# Altium schematic sheet Power3.3V.SchDoc
size A4; SheetNumber: 5; SheetTotal: 8
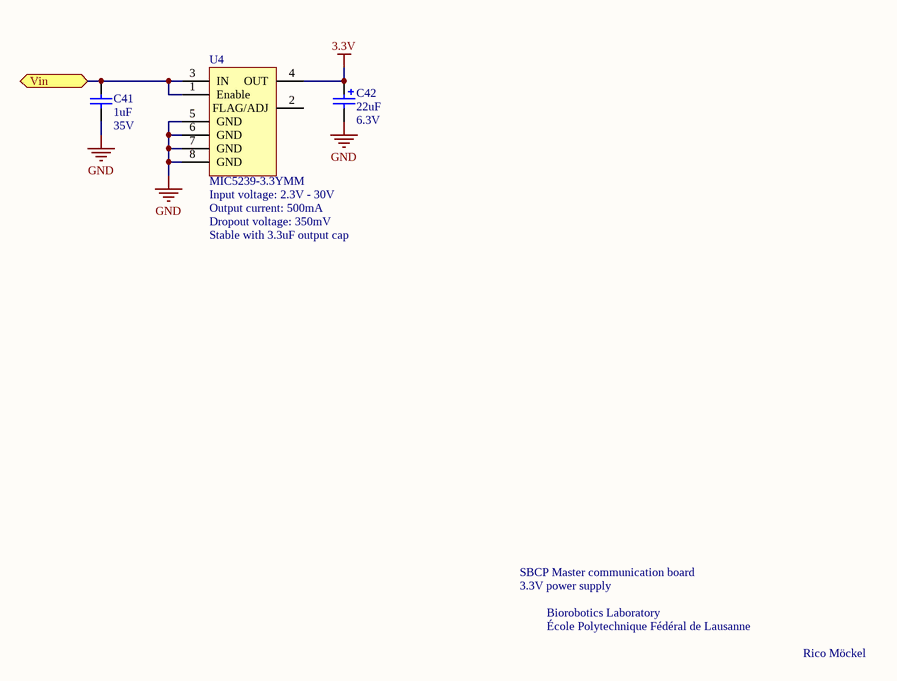
[diagram p0: Power3.3V.SchDoc]

## Parts
C41  value 1uF  Voltage: 35V  [CAPC1608N]  (hidden comment: 1uF, 35V)
C42  value 22uF  Voltage: 6.3V  [1608-10]  (hidden comment: 22uF, 6.3V)
U4  MIC5239-3.3YMM  [MSOP-8]

## Ports
Vin

## Nets
3.3V: C42.1 U4.4(OUT)
GND: C41.1 C42.2 U4.5(GND) U4.6(GND) U4.7(GND) U4.8(GND)
Vin: C41.2 U4.1(Enable) U4.3(IN) ; port Vin

Not connected (* = marked no-connect by the designer): U4 2(FLAG/ADJ)

## Notes on the sheet
- (near U4) Input voltage: 2.3V - 30V
- Dropout voltage: 350mV
- (near U4) Output current: 500mA
- Stable with 3.3uF output cap
- SBCP Master communication board
- 3.3V power supply
- École Polytechnique Fédéral de Lausanne
- Biorobotics Laboratory
- Rico Möckel

## Library data of the parts
C41 = Cap: Capacitor; Published: 8-Jun-2000; LatestRevisionDate: 17-Jul-2002; LatestRevisionNote: Re-released for DXP Platform.; PackageReference: 0603; Publisher: Altium Limited
C42 = Cap Pol2: Polarized Capacitor; Published: 8-Jun-2000; LatestRevisionDate: 17-Jul-2002; LatestRevisionNote: Re-released for DXP Platform.; PackageReference: POLAR0.8; Publisher: Altium Limited
U4 = MIC5239: LDO, 500mA, Vin:2.3V-30V